# Altium schematic sheet Debug.SchDoc
size A3; SheetNumber: 6; SheetTotal: 6
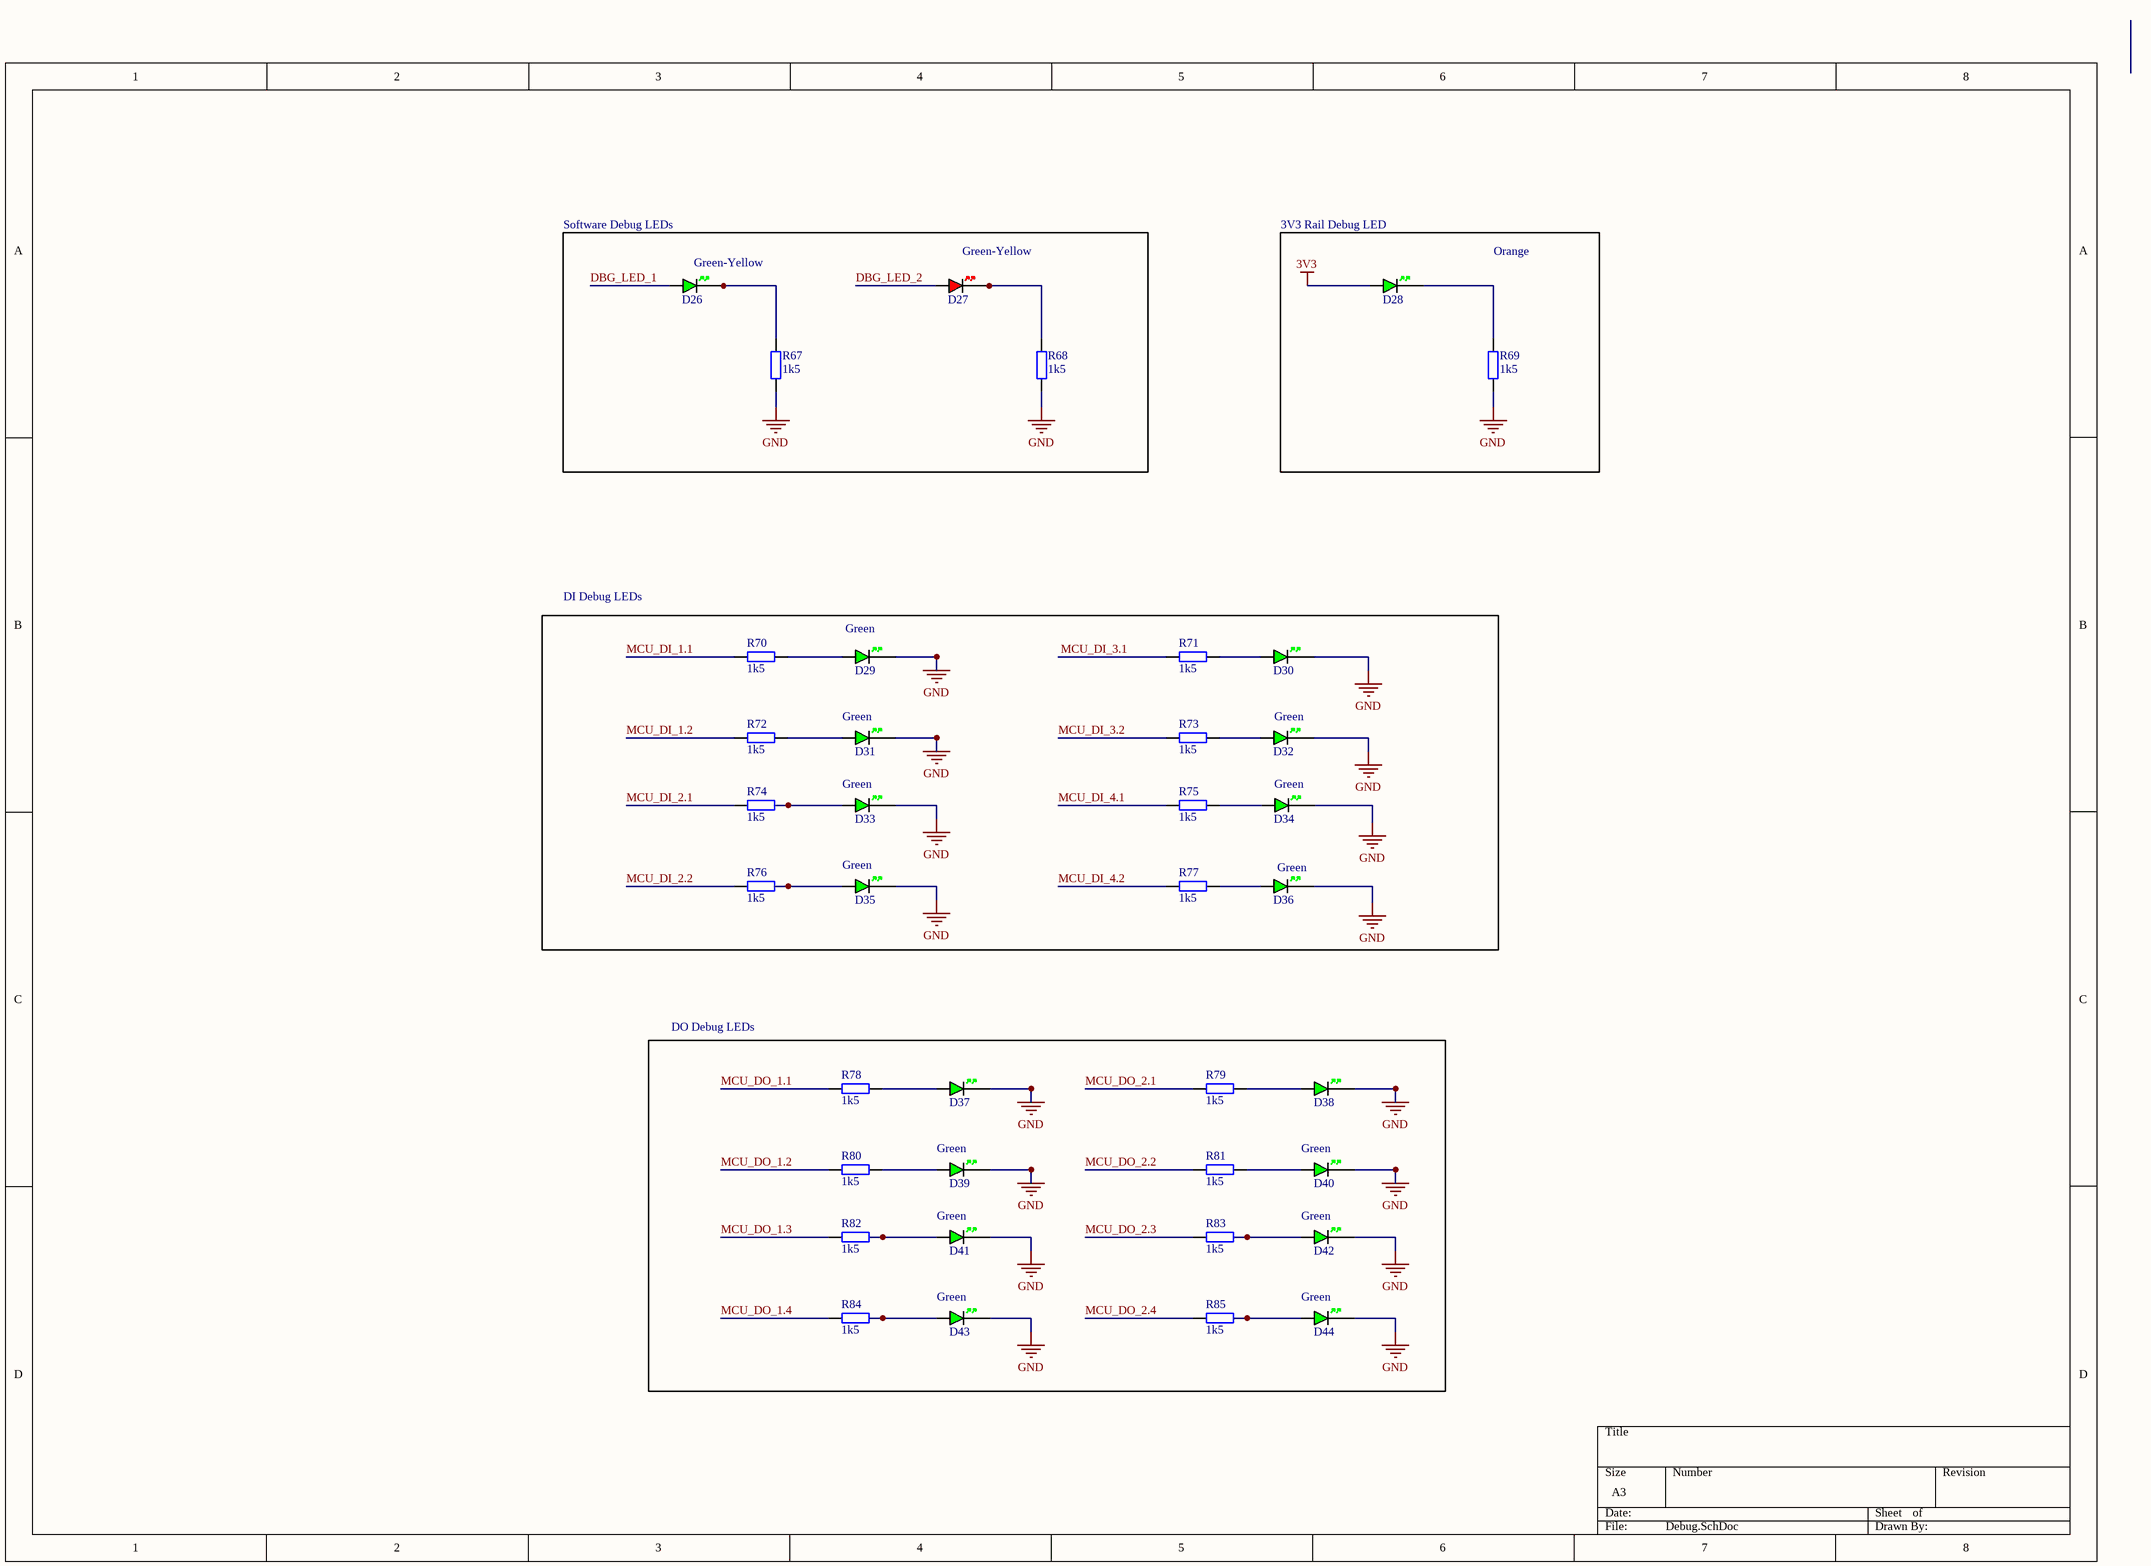
[diagram p0: Debug.SchDoc]

## Parts
D26  GREEN  [LED_0402_GREEN]  (value not drawn)
D27  RED  [LED_0402_RED]  (value not drawn)
D28  GREEN  [LED_0402_GREEN]  (value not drawn)
D29  GREEN  [LED_0402_GREEN]  (value not drawn)
D30  GREEN  [LED_0402_GREEN]  (value not drawn)
D31  GREEN  [LED_0402_GREEN]  (value not drawn)
D32  GREEN  [LED_0402_GREEN]  (value not drawn)
D33  GREEN  [LED_0402_GREEN]  (value not drawn)
D34  GREEN  [LED_0402_GREEN]  (value not drawn)
D35  GREEN  [LED_0402_GREEN]  (value not drawn)
D36  GREEN  [LED_0402_GREEN]  (value not drawn)
D37  GREEN  [LED_0402_GREEN]  (value not drawn)
D38  GREEN  [LED_0402_GREEN]  (value not drawn)
D39  GREEN  [LED_0402_GREEN]  (value not drawn)
D40  GREEN  [LED_0402_GREEN]  (value not drawn)
D41  GREEN  [LED_0402_GREEN]  (value not drawn)
D42  GREEN  [LED_0402_GREEN]  (value not drawn)
D43  GREEN  [LED_0402_GREEN]  (value not drawn)
D44  GREEN  [LED_0402_GREEN]  (value not drawn)
R67  1k5  [RES_0402]
R68  1k5  [RES_0402]
R69  1k5  [RES_0402]
R70  1k5  [RES_0402]
R71  1k5  [RES_0402]
R72  1k5  [RES_0402]
R73  1k5  [RES_0402]
R74  1k5  [RES_0402]
R75  1k5  [RES_0402]
R76  1k5  [RES_0402]
R77  1k5  [RES_0402]
R78  1k5  [RES_0402]
R79  1k5  [RES_0402]
R80  1k5  [RES_0402]
R81  1k5  [RES_0402]
R82  1k5  [RES_0402]
R83  1k5  [RES_0402]
R84  1k5  [RES_0402]
R85  1k5  [RES_0402]

## Nets
3V3: D28.A
GND: D29.K D30.K D31.K D32.K D33.K D34.K D35.K D36.K D37.K D38.K D39.K D40.K D41.K D42.K D43.K D44.K R67.1 R68.1 R69.1
DBG_LED_1: D26.A
DBG_LED_2: D27.A
MCU_DI_1.1: R70.2
MCU_DI_1.2: R72.2
MCU_DI_2.1: R74.2
MCU_DI_2.2: R76.2
MCU_DI_3.1: R71.2
MCU_DI_3.2: R73.2
MCU_DI_4.1: R75.2
MCU_DI_4.2: R77.2
MCU_DO_1.1: R78.2
MCU_DO_1.2: R80.2
MCU_DO_1.3: R82.2
MCU_DO_1.4: R84.2
MCU_DO_2.1: R79.2
MCU_DO_2.2: R81.2
MCU_DO_2.3: R83.2
MCU_DO_2.4: R85.2
NetD26_K: D26.K R67.2
NetD27_K: D27.K R68.2
NetD28_K: D28.K R69.2
NetD29_A: D29.A R70.1()
NetD30_A: D30.A R71.1()
NetD31_A: D31.A R72.1()
NetD32_A: D32.A R73.1()
NetD33_A: D33.A R74.1()
NetD34_A: D34.A R75.1()
NetD35_A: D35.A R76.1()
NetD36_A: D36.A R77.1()
NetD37_A: D37.A R78.1()
NetD38_A: D38.A R79.1()
NetD39_A: D39.A R80.1()
NetD40_A: D40.A R81.1()
NetD41_A: D41.A R82.1()
NetD42_A: D42.A R83.1()
NetD43_A: D43.A R84.1()
NetD44_A: D44.A R85.1()

## Notes on the sheet
- (near D26) Software Debug LEDs
- (near D28) 3V3 Rail Debug LED
- (near D26) Green-Yellow
- (near D27) Green-Yellow
- Orange
- DI Debug LEDs
- (near D29) Green
- (near D31) Green
- (near D32) Green
- (near D33) Green
- (near D34) Green
- (near D35) Green
- (near D36) Green
- DO Debug LEDs
- (near D39) Green
- (near D40) Green
- (near D41) Green
- (near D42) Green
- (near D43) Green
- (near D44) Green

## Library data of the parts
D26 D28-D44 = LED_0402_GREEN: LED 0402 GREEN SMD
D27 = LED_0402_RED: LED 0402 RED SMD
R67-R85 = RES_0402: Resistor SMD 0402; Manufacturer: *; Manufacturer Part Number: *; Distributor Link: *; LCSC: *